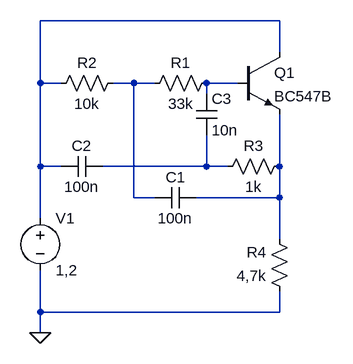
[diagram p0: schematic Draft1.asc]
Draft1.asc, the LTspice schematic file:
Version 4
SHEET 1 880 680
WIRE 320 48 -48 48
WIRE 320 96 320 48
WIRE -48 144 -48 48
WIRE -16 144 -48 144
WIRE 96 144 64 144
WIRE 128 144 96 144
WIRE 256 144 208 144
WIRE 208 160 208 144
WIRE -48 272 -48 144
WIRE -16 272 -48 272
WIRE 208 272 208 224
WIRE 208 272 48 272
WIRE 240 272 208 272
WIRE 320 272 320 192
WIRE 96 320 96 144
WIRE 128 320 96 320
WIRE 320 320 320 272
WIRE 320 320 192 320
WIRE -48 352 -48 272
WIRE 320 384 320 320
WIRE -48 496 -48 432
WIRE 320 496 320 464
WIRE 320 496 -48 496
WIRE -48 528 -48 496
FLAG -48 528 0
SYMBOL npn 256 96 R0
SYMATTR InstName Q1
SYMATTR Value BC547B
SYMBOL res 224 128 R90
WINDOW 0 0 56 VBottom 2
WINDOW 3 32 56 VTop 2
SYMATTR InstName R1
SYMATTR Value 33k
SYMBOL res 80 128 R90
WINDOW 0 0 56 VBottom 2
WINDOW 3 32 56 VTop 2
SYMATTR InstName R2
SYMATTR Value 10k
SYMBOL res 336 256 R90
WINDOW 0 0 56 VBottom 2
WINDOW 3 32 56 VTop 2
SYMATTR InstName R3
SYMATTR Value 1k
SYMBOL res 336 480 R180
WINDOW 0 36 76 Left 2
WINDOW 3 36 40 Left 2
SYMATTR InstName R4
SYMATTR Value 4,7k
SYMBOL cap 192 304 R90
WINDOW 0 0 32 VBottom 2
WINDOW 3 32 32 VTop 2
SYMATTR InstName C1
SYMATTR Value 100n
SYMBOL cap 48 256 R90
WINDOW 0 0 32 VBottom 2
WINDOW 3 32 32 VTop 2
SYMATTR InstName C2
SYMATTR Value 100n
SYMBOL voltage -48 336 R0
WINDOW 123 0 0 Left 0
WINDOW 39 0 0 Left 0
SYMATTR InstName V1
SYMATTR Value 1,2
SYMBOL cap 192 160 R0
SYMATTR InstName C3
SYMATTR Value 10n

The netlist it stands for:
* Draft1.asc
Q1 N001 N003 N005 0 BC547B
R1 N003 N002 33k
R2 N002 N001 10k
R3 N005 N004 1k
R4 0 N005 4,7k
C1 N005 N002 100n
C2 N004 N001 100n
V1 N001 0 1,2
C3 N003 N004 10n
.model NPN NPN
.model PNP PNP
.lib standard.bjt
.backanno
.end